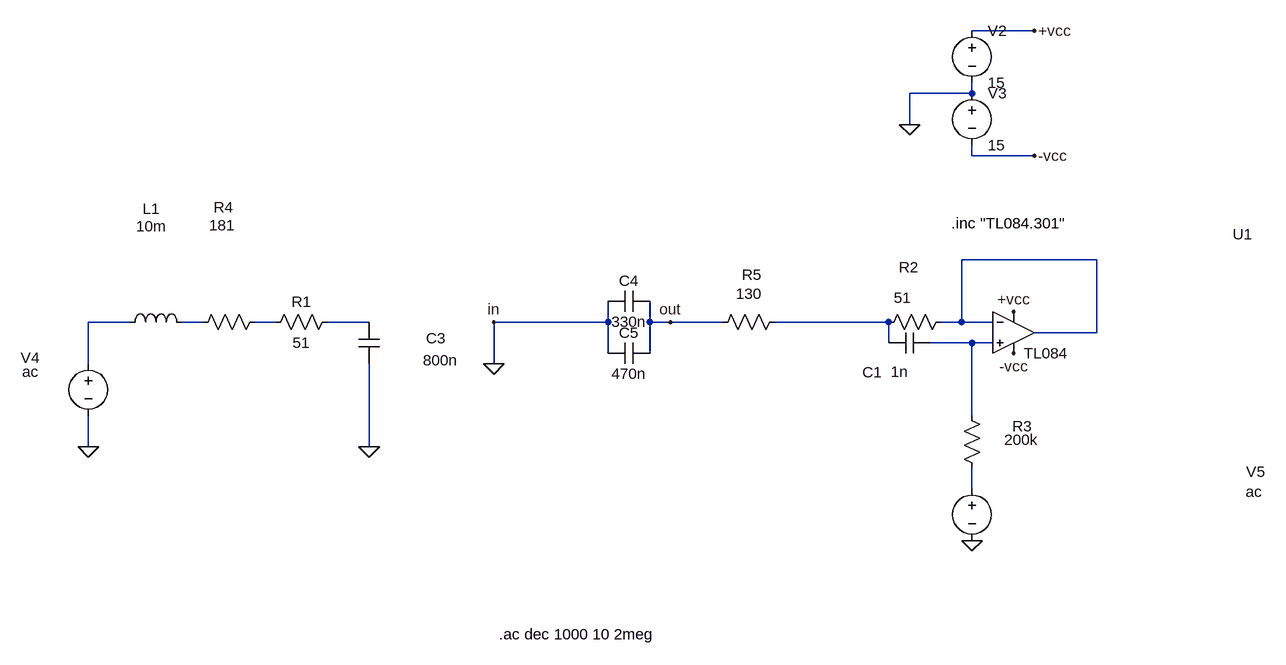
[diagram p0: schematic LP.asc]
LP.asc, the LTspice schematic file:
Version 4
SHEET 1 1204 680
WIRE 816 -368 720 -368
WIRE 720 -272 720 -288
WIRE 720 -272 624 -272
WIRE 624 -224 624 -272
WIRE 720 -176 720 -192
WIRE 816 -176 720 -176
WIRE 912 -16 704 -16
WIRE -576 80 -640 80
WIRE -464 80 -496 80
WIRE -352 80 -384 80
WIRE -208 80 -272 80
WIRE 160 80 160 48
WIRE 160 80 -16 80
WIRE 224 80 224 48
WIRE 256 80 224 80
WIRE 336 80 256 80
WIRE 592 80 416 80
WIRE 704 80 704 -16
WIRE 704 80 672 80
WIRE 752 80 704 80
WIRE 912 96 912 -16
WIRE 912 96 816 96
WIRE 592 112 592 80
WIRE 720 112 656 112
WIRE 752 112 720 112
WIRE 160 128 160 80
WIRE 224 128 224 80
WIRE -640 144 -640 80
WIRE -16 144 -16 80
WIRE 720 224 720 112
WIRE -640 272 -640 224
WIRE -208 272 -208 144
WIRE 720 336 720 304
FLAG 816 -368 +vcc
FLAG 784 64 +vcc
FLAG 816 -176 -vcc
FLAG 784 128 -vcc
FLAG 624 -224 0
FLAG -16 80 in
FLAG 256 80 out
FLAG -640 272 0
FLAG -208 272 0
FLAG 720 416 0
FLAG -16 144 0
SYMBOL Opamps\\opamp2 784 32 R0
WINDOW 0 337 -87 Left 2
SYMATTR InstName U1
SYMATTR Value TL084
SYMBOL voltage 720 -384 R0
SYMATTR InstName V2
SYMATTR Value 15
SYMBOL voltage 720 -288 R0
SYMATTR InstName V3
SYMATTR Value 15
SYMBOL cap 656 96 R90
WINDOW 0 77 89 VBottom 2
WINDOW 3 45 47 VTop 2
SYMATTR InstName C1
SYMATTR Value 1n
SYMBOL res 688 64 R90
WINDOW 0 -53 65 VBottom 2
WINDOW 3 -37 75 VTop 2
SYMATTR InstName R2
SYMATTR Value 51
SYMBOL res 704 208 R0
WINDOW 0 78 32 Left 2
WINDOW 3 66 53 Left 2
SYMATTR InstName R3
SYMATTR Value 200k
SYMBOL voltage -640 128 R0
WINDOW 123 0 0 Left 0
WINDOW 39 0 0 Left 0
WINDOW 0 -104 7 Left 2
WINDOW 3 -102 28 Left 2
SYMATTR InstName V4
SYMATTR Value ac
SYMBOL res -368 64 R90
WINDOW 0 -145 64 VBottom 2
WINDOW 3 -149 66 VTop 2
SYMATTR InstName R4
SYMATTR Value 181
SYMBOL ind -592 96 R270
WINDOW 0 175 49 VTop 2
WINDOW 3 179 49 VBottom 2
SYMATTR InstName L1
SYMATTR Value 10m
SYMBOL cap -224 80 R0
WINDOW 0 104 25 Left 2
WINDOW 3 99 59 Left 2
SYMATTR InstName C3
SYMATTR Value 800n
SYMBOL voltage 720 320 R0
WINDOW 123 0 0 Left 0
WINDOW 39 0 0 Left 0
WINDOW 0 422 -10 Left 2
WINDOW 3 421 21 Left 2
SYMATTR InstName V5
SYMATTR Value ac
SYMBOL res 432 64 R90
WINDOW 0 -41 51 VBottom 2
WINDOW 3 -43 55 VTop 2
SYMATTR InstName R5
SYMATTR Value 130
SYMBOL cap 224 32 R90
WINDOW 0 0 32 VBottom 2
WINDOW 3 32 32 VTop 2
SYMATTR InstName C4
SYMATTR Value 330n
SYMBOL cap 224 112 R90
WINDOW 0 0 32 VBottom 2
WINDOW 3 32 32 VTop 2
SYMATTR InstName C5
SYMATTR Value 470n
SYMBOL res -256 64 R90
WINDOW 0 0 56 VBottom 2
WINDOW 3 32 56 VTop 2
SYMATTR InstName R1
SYMATTR Value 51
TEXT -8 560 Left 2 !.ac dec 1000 10 2meg
TEXT 688 -72 Left 2 !.inc "TL084.301"

The netlist it stands for:
* LP.asc
XU1 N007 N001 +vcc -vcc N001 TL084  ; pins In+ In- V+ V- OUT
V2 +vcc 0 15
V3 0 -vcc 15
C1 N007 N006 1n
R2 N001 N006 51
R3 N007 N008 200k
V4 N002 0 ac
R4 N004 N003 181
L1 N002 N003 10m
C3 N005 0 800n
V5 N008 0 ac
R5 N006 out 130
C4 out 0 330n
C5 out 0 470n
R1 N005 N004 51
.ac dec 1000 10 2meg
.inc "TL084.301"
.backanno
.end